# EAGLE schematic control (EAGLE 7.2.0)
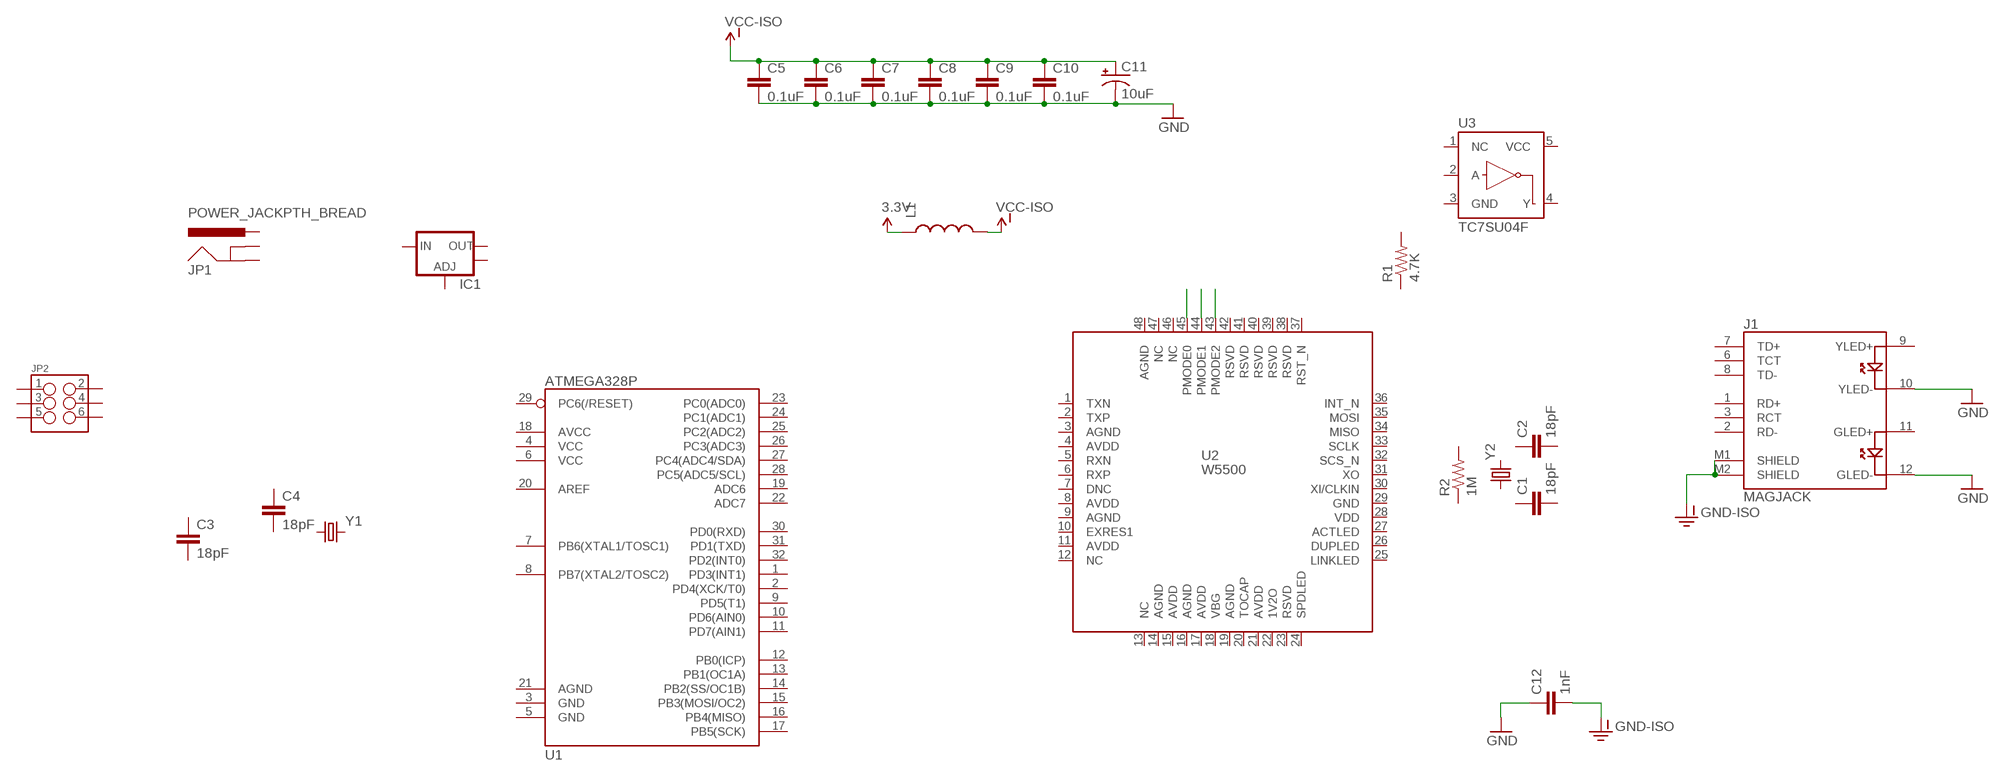
[diagram p0: schematic, sheet 1]

## Parts
C1  18pF  18PF-50V-5%(0603)  [0603-CAP]
C2  18pF  18PF-50V-5%(0603)  [0603-CAP]
C3  18pF  18PF-50V-5%(0603)  [0603-CAP]
C4  18pF  18PF-50V-5%(0603)  [0603-CAP]
C5  0.1uF  0.1UF-25V-5%(0603)  [0603-CAP]
C6  0.1uF  0.1UF-25V-5%(0603)  [0603-CAP]
C7  0.1uF  0.1UF-25V-5%(0603)  [0603-CAP]
C8  0.1uF  0.1UF-25V-5%(0603)  [0603-CAP]
C9  0.1uF  0.1UF-25V-5%(0603)  [0603-CAP]
C10  0.1uF  0.1UF-25V-5%(0603)  [0603-CAP]
C11  10uF  10UF-16V-10%(TANT)  [EIA3216]
C12  1nF  1NF/1000PF-50V-10%(0603)  [0603-CAP]
IC1  V_REG_LM1117SOT223  [SOT223]
J1  MAGJACK  [MAGJACK]
JP1  POWER_JACKPTH_BREAD  [POWER_JACK_PTH_BREAD]
JP2  M03X2SHROUD  [2X3-SHROUDED]
L1  INDUCTOR0603  [0603]
R1  4.7K  4.7KOHM-1/10W-1%(0603)  [0603-RES]
R2  1M  1MOHM-1/10W-1%(0603)  [0603-RES]
U1  ATMEGA328P  ATMEGA328_SMT  [TQFP32-08]
U2  W5500  [W5500]
U3  TC7SU04F  INVERTER_SOT23-5  [SOT23-5]
Y1  CRYSTALHC49US  [HC49US]
Y2  CRYSTALHC49US  [HC49US]

## Nets
3.3V: L1.1
GND: C5.2 C6.2 C7.2 C8.2 C9.2 C10.2 C11.C(-) C12.1 J1.10(YLED-) J1.12(GLED-)
GND-ISO: C12.2 J1.M1(SHIELD) J1.M2(SHIELD)
N$4: U2.45(PMODE0)
N$5: U2.44(PMODE1)
N$6: U2.43(PMODE2)
VCC-ISO: C5.1 C6.1 C7.1 C8.1 C9.1 C10.1 C11.A(+) L1.2
Unconnected: C1.1 C1.2 C2.1 C2.2 C3.1 C3.2 C4.1 C4.2 IC1.1(ADJ) IC1.2(OUT) IC1.3(IN) IC1.4(OUT) J1.1(RD+) J1.2(RD-) J1.3(RCT) J1.6(TCT) J1.7(TD+) J1.8(TD-) J1.9(YLED+) J1.11(GLED+) JP1.GND JP1.GNDBREAK JP1.PWR JP2.1 JP2.2 JP2.3 JP2.4 JP2.5 JP2.6 R1.1 R1.2 R2.1 R2.2 U1.1(PD3(INT1)) U1.2(PD4(XCK/T0)) U1.3(GND) U1.4(VCC) U1.5(GND) U1.6(VCC) U1.7(PB6(XTAL1/TOSC1)) U1.8(PB7(XTAL2/TOSC2)) U1.9(PD5(T1)) U1.10(PD6(AIN0)) U1.11(PD7(AIN1)) U1.12(PB0(ICP)) U1.13(PB1(OC1A)) U1.14(PB2(SS/OC1B)) U1.15(PB3(MOSI/OC2)) U1.16(PB4(MISO)) U1.17(PB5(SCK)) U1.18(AVCC) U1.19(ADC6) U1.20(AREF) U1.21(AGND) U1.22(ADC7) U1.23(PC0(ADC0)) U1.24(PC1(ADC1)) U1.25(PC2(ADC2)) U1.26(PC3(ADC3)) U1.27(PC4(ADC4/SDA)) U1.28(PC5(ADC5/SCL)) U1.29(PC6(/RESET)) U1.30(PD0(RXD)) U1.31(PD1(TXD)) U1.32(PD2(INT0)) U2.1(TXN) U2.2(TXP) U2.3(AGND) U2.4(AVDD) U2.5(RXN) U2.6(RXP) U2.7(DNC) U2.8(AVDD) U2.9(AGND) U2.10(EXRES1) U2.11(AVDD) U2.12(NC) U2.13(NC) U2.14(AGND) U2.15(AVDD) U2.16(AGND) U2.17(AVDD) U2.18(VBG) U2.19(AGND) U2.20(TOCAP) U2.21(AVDD) U2.22(1V2O) U2.23(RSVD) U2.24(SPDLED) U2.25(LINKLED) U2.26(DUPLED) U2.27(ACTLED) U2.28(VDD) U2.29(GND) U2.30(XI/CLKIN) U2.31(XO) U2.32(SCS_N) U2.33(SCLK) U2.34(MISO) U2.35(MOSI) U2.36(INT_N) U2.37(RST_N) U2.38(RSVD) U2.39(RSVD) U2.40(RSVD) U2.41(RSVD) U2.42(RSVD) U2.46(NC) U2.47(NC) U2.48(AGND) U3.1(NC) U3.2(A) U3.3(GND) U3.4(Y) U3.5(VCC) Y1.1 Y1.2 Y2.1 Y2.2

## Library data of the parts
C1-C4 = SparkFun-Capacitors:18PF-50V-5%(0603): CAP-08267; PROD_ID: CAP-08267
C5-C10 = SparkFun-Capacitors:0.1UF-25V-5%(0603): CAP-08604; PROD_ID: CAP-08604
C11 = SparkFun-Capacitors:10UF-16V-10%(TANT): CAP-00811 1206/EIA-3216 Tantalum capacitor; PROD_ID: CAP-00811
C12 = SparkFun-Capacitors:1NF/1000PF-50V-10%(0603): CAP-07886; PROD_ID: CAP-07886
IC1 = SparkFun-PowerIC:V_REG_LM1117: Voltage Regulator LM1117 Standard adjustable voltage regulator but in SMD form. Spark Fun Electronics SKU : COM-00595; PROD_ID: VREG-08170
J1 = SparkFun-Connectors:MAGJACK: RJ-45 with LEDs
JP1 = SparkFun-Connectors:POWER_JACK: Power Jack This is the standard 5.5mm barrel jack for power. The PTH is the most common, proven, reliable, footprint. The Slot footprint only works if the mill layer is transmitted to the PCB fab house so be warned. Mating wall wart : TOL-00298 (and others); PROD_ID: PRT-10811
JP2 = SparkFun-Connectors:M03X2: 2x3 .1" header. Shrouded, with keying- CONN-10681 SMT- CONN-11415 Pogo pins- HW-11044; PROD_ID: CONN-10681
L1 = SparkFun-Passives:INDUCTOR: Inductors Basic Inductor/Choke - 0603 and 1206. Footprints are not proven and vary greatly between part numbers. SRN6045- 33uH, 20% 1.4A SDR0403-560KL - 56uH, 10%, 500mA RMS/740mA peak
R1 = SparkFun-Resistors:4.7KOHM-1/10W-1%(0603): RES-07857; PROD_ID: RES-07857
R2 = SparkFun-Resistors:1MOHM-1/10W-1%(0603): RES-07868; PROD_ID: RES-07868
U1 = SparkFun-DigitalIC:ATMEGA328_SMT: 32-Pin Atmega328 part Commonly used on Arduino compatible boards Available in QFP and QFN packages TQFP is IC-09069 QFN is non-stock; PROD_ID: IC-09069
U2 = W5500:W5500
U3 = SparkFun-DigitalIC:INVERTER: Single inverter, SOT23-5; NOTE: RETIRED; PROD_ID: 8211
Y1 Y2 = SparkFun-FreqCtrl:CRYSTAL: Various standard crystals. Proven footprints.